# Altium schematic sheet Misc.SchDoc
size A3
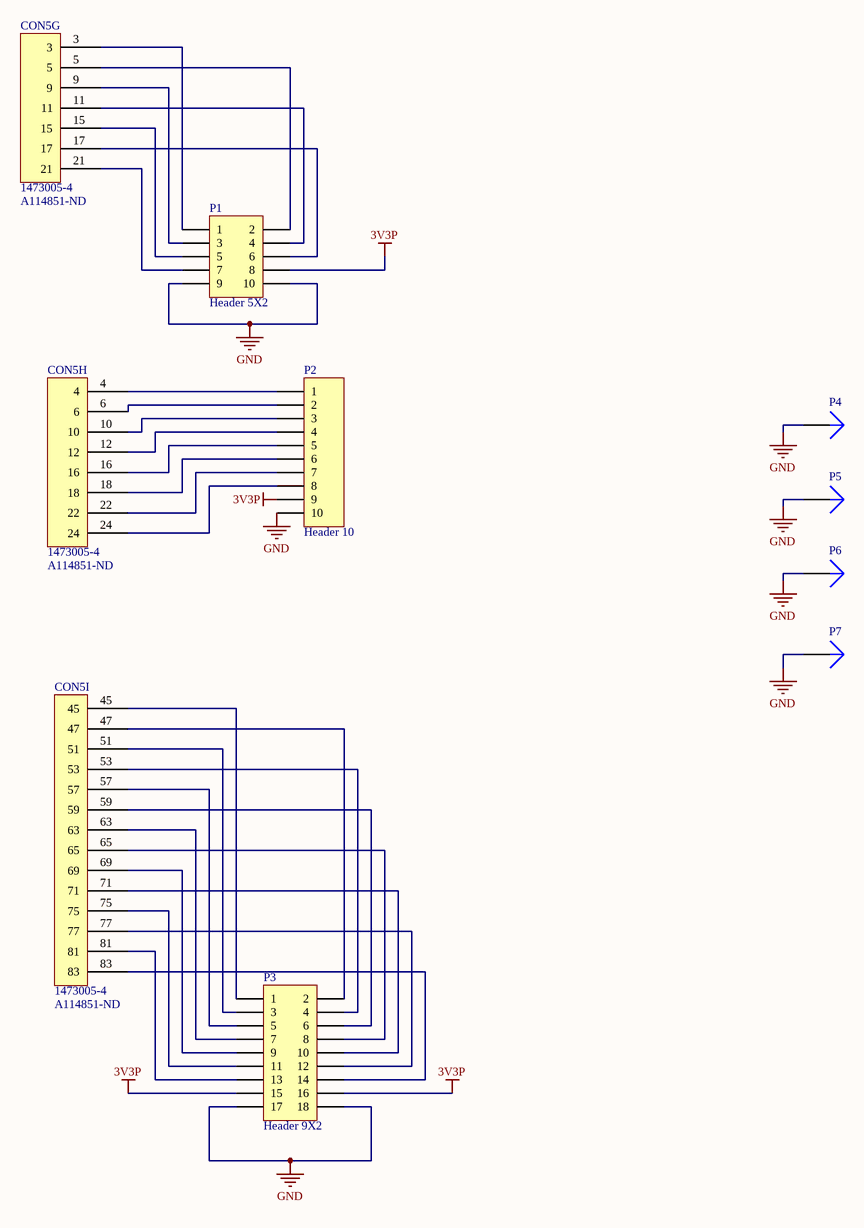
[diagram p0: Misc.SchDoc]

## Parts
CON5  1473005-4  Supplier Part Number 1: A114851-ND  [SODIMM SOCKET .6 PITCH 200 POS RIGHT ANGLE]  (parts G,H,I of 9)
P1  Header 5X2  [HDR2X5]
P2  Header 10  [HDR1X10]
P3  Header 9X2  [HDR2X9]
P4  Plug  [PIN1]  (value not drawn)
P5  Plug  [PIN1]  (value not drawn)
P6  Plug  [PIN1]  (value not drawn)
P7  Plug  [PIN1]  (value not drawn)

## Nets
3V3P: P1.8 P2.9 P3.15 P3.16
GND: P1.9 P1.10 P2.10 P3.17 P3.18 P4.1 P5.1 P6.1 P7.1
NetCON5_3: CON5.3 P1.1
NetCON5_4: CON5.4 P2.1
NetCON5_5: CON5.5 P1.2
NetCON5_6: CON5.6 P2.2
NetCON5_9: CON5.9 P1.3
NetCON5_10: CON5.10 P2.3
NetCON5_11: CON5.11 P1.4
NetCON5_12: CON5.12 P2.4
NetCON5_15: CON5.15 P1.5
NetCON5_16: CON5.16 P2.5
NetCON5_17: CON5.17 P1.6
NetCON5_18: CON5.18 P2.6
NetCON5_21: CON5.21 P1.7
NetCON5_22: CON5.22 P2.7
NetCON5_24: CON5.24 P2.8
NetCON5_45: CON5.45 P3.1
NetCON5_47: CON5.47 P3.2
NetCON5_51: CON5.51 P3.3
NetCON5_53: CON5.53 P3.4
NetCON5_57: CON5.57 P3.5
NetCON5_59: CON5.59 P3.6
NetCON5_63: CON5.63 P3.7
NetCON5_65: CON5.65 P3.8
NetCON5_69: CON5.69 P3.9
NetCON5_71: CON5.71 P3.10
NetCON5_75: CON5.75 P3.11
NetCON5_77: CON5.77 P3.12
NetCON5_81: CON5.81 P3.13
NetCON5_83: CON5.83 P3.14

## Library data of the parts
CON5 = 1473005-4: Manufacturer: TE Connectivity (Tyco Electronics); Unit PriceUSD: AMP; Minimum Quantity: SODIMM; 3D Model: 1473005-4.pdf; Number of Positions: 200; Memory Type: DDR 2 SDRAM; Other Names: 1473005-4-ND / A114851; Supplier 1: Digikey; Manufacturer Part Number: 1473005-4; Stock 1: 1922; Pricing 1: 1=3.9, 10=3.744, 50=3.276, 100=3.12, 250=2.73, 500=2.652, 1000=2.262, 2500=2.106 (USD); Quantity Available: Tray; RoHS Information: 1473005-4 Statement of Compliance / RoHS 2 Statement; Standard Package: 20; Category: Connectors, Interconnects; Family: Memory Connectors - Inline Module Sockets; Series: AMP; Packaging: Tray; Connector Style: SODIMM; Mounting Type: Surface Mount, Right Angle; Features: Board Guide, Latches; Mounting Feature: Standard; Contact Finish: Gold; Contact Finish Thickness: Flash; ComponentLink1URL: https://datasheet.ciiva.com/682/eng-cd-1473005-j2-682720.pdf; ComponentLink1Description: https://datasheet.ciiva.com/682/eng-cd-1473005-j2-682720.pdf; ComponentLink2URL: https://datasheet.ciiva.com/15171/getdatasheetpartid-99150-15171488.pdf; ComponentLink2Description: https://datasheet.ciiva.com/15171/getdatasheetpartid-99150-15171488.pdf; ComponentLink3URL: https://datasheet.ciiva.com/1105/582309-1105221.pdf; ComponentLink3Description: https://datasheet.ciiva.com/1105/582309-1105221.pdf; ComponentLink4URL: https://datasheet.ciiva.com/682/eng-cd-1473005-j2-682726.pdf; ComponentLink4Description: https://datasheet.ciiva.com/682/eng-cd-1473005-j2-682726.pdf; ComponentLink5URL: https://datasheet.ciiva.com/14156/04821302-14156311.pdf; ComponentLink5Description: https://datasheet.ciiva.com/14156/04821302-14156311.pdf; ComponentLink6URL: https://datasheet.ciiva.com/3136/eng-cd-1473005-j-3136060.pdf; ComponentLink6Description: https://datasheet.ciiva.com/3136/eng-cd-1473005-j-3136060.pdf; ComponentLink7URL: https://datasheet.ciiva.com/16380/eng-cd-1473005-j-16380909.pdf; ComponentLink7Description: https://datasheet.ciiva.com/16380/eng-cd-1473005-j-16380909.pdf; ComponentLink8URL: https://datasheet.ciiva.com/16651/eng-cd-1473005-j-16651646.pdf; ComponentLink8Description: https://datasheet.ciiva.com/16651/eng-cd-1473005-j-16651646.pdf
P1 = Header 5X2: Header, 5-Pin, Dual row; LatestRevisionDate: 17-Jul-2002; LatestRevisionNote: Re-released for DXP Platform.; Publisher: Altium Limited
P2 = Header 10: Header, 10-Pin; LatestRevisionDate: 17-Jul-2002; LatestRevisionNote: Re-released for DXP Platform.; Publisher: Altium Limited
P3 = Header 9X2: Header, 9-Pin, Dual row; LatestRevisionDate: 17-Jul-2002; LatestRevisionNote: Re-released for DXP Platform.; Publisher: Altium Limited
P4-P7 = Plug: LatestRevisionDate: 17-Jul-2002; LatestRevisionNote: Re-released for DXP Platform.; Publisher: Altium Limited